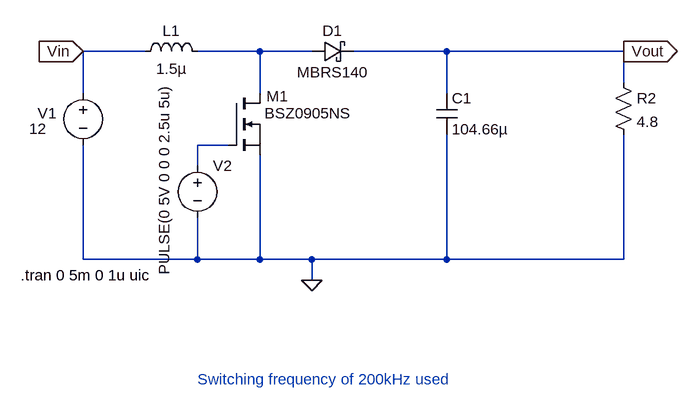
[diagram p0: schematic Boost_Converter.asc]
Boost_Converter.asc, the LTspice schematic file:
Version 4
SHEET 1 1836 680
WIRE 176 48 80 48
WIRE 352 48 256 48
WIRE 432 48 352 48
WIRE 640 48 496 48
WIRE 912 48 640 48
WIRE 912 96 912 48
WIRE 80 112 80 48
WIRE 352 112 352 48
WIRE 640 112 640 48
WIRE 304 192 256 192
WIRE 256 224 256 192
WIRE 80 368 80 192
WIRE 256 368 256 304
WIRE 256 368 80 368
WIRE 352 368 352 208
WIRE 352 368 256 368
WIRE 432 368 352 368
WIRE 640 368 640 176
WIRE 640 368 432 368
WIRE 912 368 912 176
WIRE 912 368 640 368
WIRE 432 400 432 368
FLAG 432 400 0
FLAG 912 48 Vout
IOPIN 912 48 Out
FLAG 80 48 Vin
IOPIN 80 48 In
SYMBOL voltage 80 96 R0
WINDOW 0 -70 47 Left 2
WINDOW 3 -83 71 Left 2
WINDOW 123 0 0 Left 2
WINDOW 39 0 0 Left 2
SYMATTR InstName V1
SYMATTR Value 12
SYMBOL nmos 304 112 R0
WINDOW 0 58 5 Left 2
WINDOW 3 55 31 Left 2
SYMATTR InstName M1
SYMATTR Value BSZ0905NS
SYMBOL schottky 432 64 R270
WINDOW 0 32 32 VTop 2
WINDOW 3 0 32 VBottom 2
SYMATTR InstName D1
SYMATTR Value MBRS140
SYMATTR Description Diode
SYMATTR Type diode
SYMBOL ind 160 64 R270
WINDOW 0 32 56 VTop 2
WINDOW 3 5 56 VBottom 2
SYMATTR InstName L1
SYMATTR Value 1.5µ
SYMATTR SpiceLine Ipk=3 Rser=0.0105 Rpar=31086 Cpar=0
SYMBOL voltage 256 208 R0
WINDOW 3 -51 -109 VRight 2
WINDOW 123 0 0 Left 2
WINDOW 39 0 0 Left 2
SYMATTR Value PULSE(0 5V 0 0 0 2.5u 5u)
SYMATTR InstName V2
SYMBOL cap 624 112 R0
SYMATTR InstName C1
SYMATTR Value 104.66µ
SYMBOL res 896 80 R0
SYMATTR InstName R2
SYMATTR Value 4.8
TEXT -16 392 Left 2 !.tran 0 5m 0 1u uic
TEXT 256 552 Left 2 ;Switching frequency of 200kHz used

The netlist it stands for:
* Boost_Converter.asc
V1 Vin 0 12
M1 N001 N002 0 0 BSZ0905NS
D1 N001 Vout MBRS140
L1 Vin N001 1.5µ Ipk=3 Rser=0.0105 Rpar=31086 Cpar=0
V2 N002 0 PULSE(0 5V 0 0 0 2.5u 5u)
C1 Vout 0 104.66µ
R2 Vout 0 4.8
.model D D
.lib standard.dio
.model NMOS NMOS
.model PMOS PMOS
.lib standard.mos
.tran 0 5m 0 1u uic
* Switching frequency of 200kHz used
.backanno
.end